# Altium schematic sheet Gate_Driver.SchDoc
size A3; DocumentNumber: 5; SheetNumber: 5; SheetTotal: 10
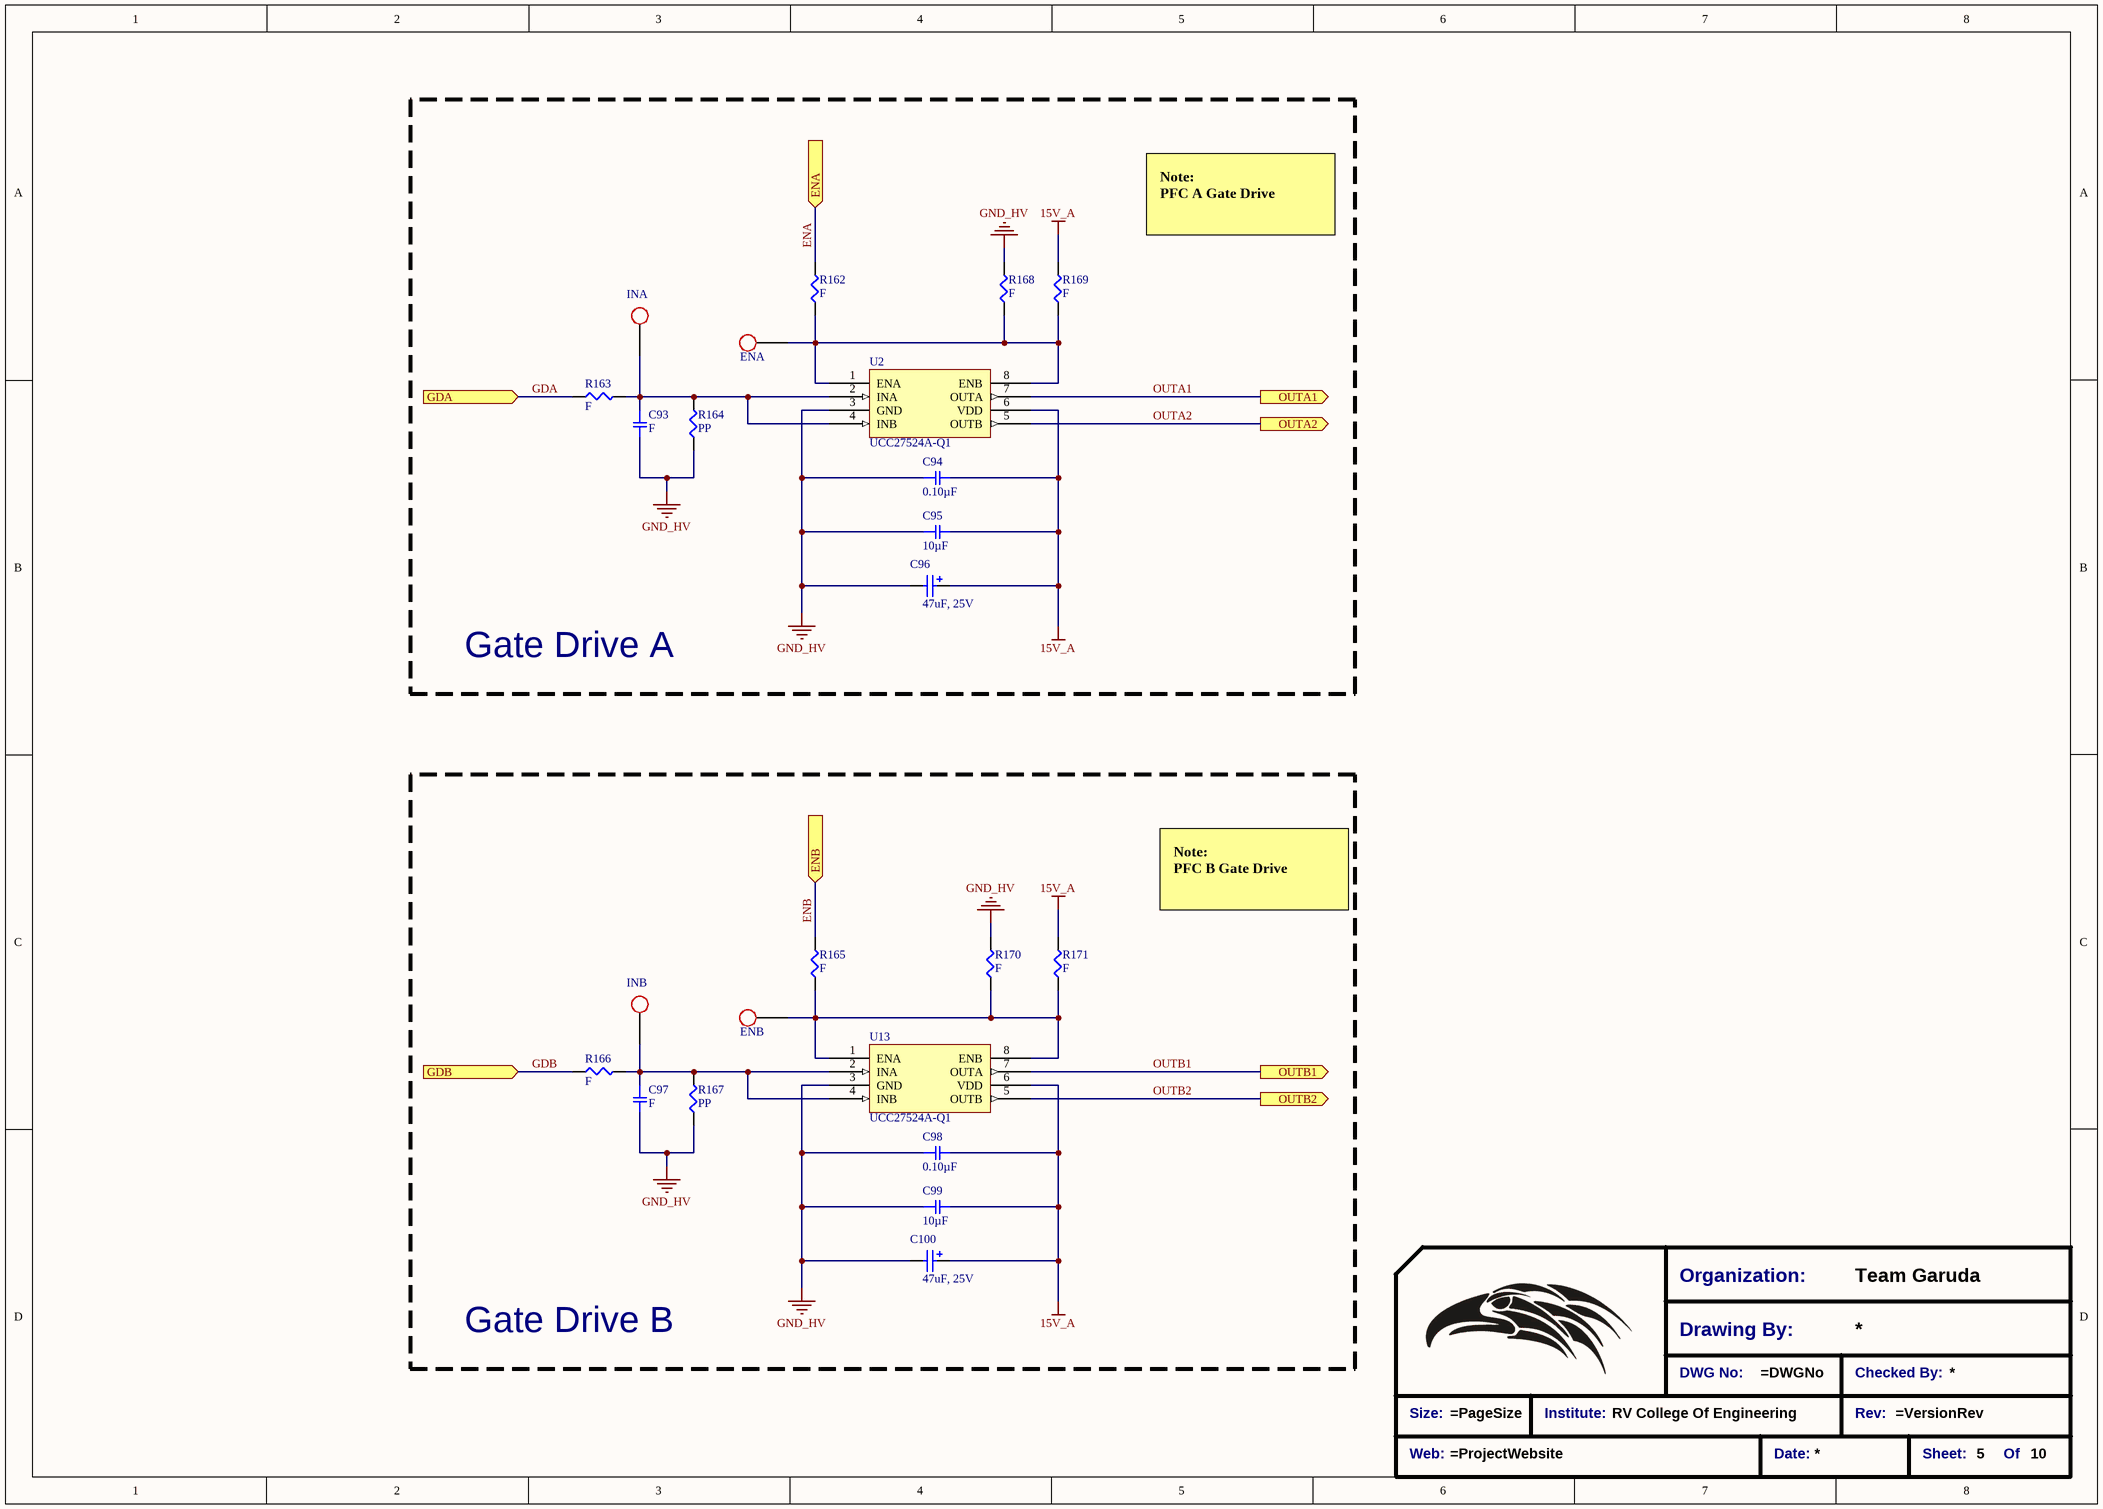
[diagram p0: Gate_Driver.SchDoc]

## Parts
*?  Title_Block  (value not drawn)  (graphical)
C93  F  [SMD-0805C]
C94  0.10µF  [SMD-0805C]
C95  10µF  [SMD-1206C]
C96  47uF, 25V  [WCAP-ASLU_6.3x7.7]
C97  F  [SMD-0805C]
C98  0.10µF  [SMD-0805C]
C99  10µF  [SMD-1206C]
C100  47uF, 25V  [WCAP-ASLU_6.3x7.7]
ENA  Test Point  [Test_point_SMD]  (value not drawn)  (no BOM)
ENB  Test Point  [Test_point_SMD]  (value not drawn)  (no BOM)
INA  Test Point  [Test_point_SMD]  (value not drawn)  (no BOM)
INB  Test Point  [Test_point_SMD]  (value not drawn)  (no BOM)
R162  F  [SMD-0805-RES]
R163  F  [SMD-0805-RES]
R164  PP  [SMD-0805-RES]
R165  F  [SMD-0805-RES]
R166  F  [SMD-0805-RES]
R167  PP  [SMD-0805-RES]
R168  F  [SMD-0805-RES]
R169  F  [SMD-0805-RES]
R170  F  [SMD-0805-RES]
R171  F  [SMD-0805-RES]
U2  UCC27524A-Q1  [SOIC127P570X175_HS-9N - No Thermal]
U13  UCC27524A-Q1  [SOIC127P570X175_HS-9N - No Thermal]

## Blocks framed on the sheet
Gate Drive A: C93-C96 ENA INA R162-R164 R168 R169 U2
Gate Drive B: C97-C100 ENB INB R165-R167 R170 R171 U13

## Ports
ENA (in), ENB (in), GDA (in), GDB (in), OUTA1 (out), OUTA2 (out), OUTB1 (out), OUTB2 (out)

## Nets
15V_A: C94.2 C95.2 C96.2(P) C98.2 C99.2 C100.2(P) R169.2 R171.2 U2.6(VDD) U13.6(VDD)
GND_HV: C93.2 C94.1 C95.1 C96.1(N) C97.2 C98.1 C99.1 C100.1(N) R164.1 R167.1 R168.2 R170.2 U2.3(GND) U13.3(GND)
ENA: R162.2 ; port ENA
ENB: R165.2 ; port ENB
GDA: R163.1 ; port GDA
GDB: R166.1 ; port GDB
OUTA1: U2.7(OUTA) ; port OUTA1
OUTA2: U2.5(OUTB) ; port OUTA2
OUTB1: U13.7(OUTA) ; port OUTB1
OUTB2: U13.5(OUTB) ; port OUTB2
NetC93_1: C93.1 INA.1 R163.2 R164.2 U2.2(INA) U2.4(INB)
NetC97_1: C97.1 INB.1 R166.2 R167.2 U13.2(INA) U13.4(INB)
NetENA_1: ENA.1 R162.1 R168.1 R169.1 U2.1(ENA) U2.8(ENB)
NetENB_1: ENB.1 R165.1 R170.1 R171.1 U13.1(ENA) U13.8(ENB)

## Notes on the sheet
- Note:
  PFC A Gate Drive
- Note:
  PFC B Gate Drive
- (in symbol Title_Block) Organization:; Team Garuda; Drawing By:; DWG No:; Checked By:; Size:; Institute:; RV College Of Engineering; Rev:; Web:; Date:; Sheet:; Of

## Library data of the parts
*? = Title_Block: Standard Title Block
C93 C97 = GCM219R71H334KA55D: CAP CER 0.33UF 50V X7R 0805; Manufacturer: Murata Electronics North America; Factory Stock: 0; Unit Price (USD): 0.4; Minimum Quantity: 1; Value: 0.33µF; Tolerance: ±10%; Datasheets: http://www.murata.com/~/media/webrenewal/support/library/catalog/products/capacitor/mlcc/c03e.ashx; Image: //media.digikey.com/photos/Murata%20Photos/NCP,GCM%20SERIES%200805.jpg; Digi-Key Part Number: 490-8045-1-ND; Part Number: GCM219R71H334KA55D; Quantity Available: 22035; @ qty: 0; Packaging: Cut Tape (CT); Series: GCM; Part Status: Active; Voltage: 50V; Temperature Coefficient: X7R; Operating Temperature: -55°C ~ 125°C; Features: -; Ratings: AEC-Q200; Applications: Automotive; Mounting Type: Surface Mount, MLCC; Package / Case: 0805 (2012 Metric); Size / Dimension: 0.079" L x 0.049" W (2.00mm x 1.25mm); Height - Seated (Max): -; Thickness (Max): 0.037" (0.95mm); Lead Spacing: -; Lead Style: -
C94 C98 = GCD21BR71H104KA01L: CAP CER 0.1UF 50V X7R 0805; Manufacturer: Murata Electronics North America; Factory Stock: 0; Unit Price (USD): 0.24; Minimum Quantity: 1; Tolerance: ±10%; Datasheets: http://www.murata.com/~/media/webrenewal/support/library/catalog/products/capacitor/mlcc/c03e.ashx; Image: //media.digikey.com/Renders/Murata%20Renders/0805%28GxM6%29.jpg; Digi-Key Part Number: 490-11955-1-ND; Part Number: GCD21BR71H104KA01L; Quantity Available: 157; @ qty: 0; Packaging: Cut Tape (CT); Series: GCD; Part Status: Active; Value: 0.10µF; Voltage: 50V; Temperature Coefficient: X7R; Operating Temperature: -55°C ~ 125°C; Features: -; Ratings: AEC-Q200; Applications: Automotive; Mounting Type: Surface Mount, MLCC; Package / Case: 0805 (2012 Metric); Size / Dimension: 0.079" L x 0.049" W (2.00mm x 1.25mm); Height - Seated (Max): -; Thickness (Max): 0.049" (1.25mm); Lead Spacing: -; Lead Style: -
C95 C99 = GRT31CR61E106ME01L: CAP CER 10UF 25V X5R 1206; Manufacturer: Murata Electronics North America; Factory Stock: 0; Unit Price (USD): 0.56; Minimum Quantity: 1; Tolerance: ±20%; Datasheets: http://search.murata.co.jp/Ceramy/image/img/A01X/G101/ENG/GRT31CR61E106ME01-01.pdf; Image: //media.digikey.com/Renders/Murata%20Renders/GR331BD72E473KW01L.jpg; Digi-Key Part Number: 490-12449-1-ND; Part Number: GRT31CR61E106ME01L; Quantity Available: 4000; @ qty: 0; Packaging: Cut Tape (CT); Series: GRT; Part Status: Active; Value: 10µF; Voltage: 25V; Temperature Coefficient: X5R; Operating Temperature: -55°C ~ 85°C; Features: -; Ratings: AEC-Q200; Applications: Automotive; Mounting Type: Surface Mount, MLCC; Package / Case: 1206 (3216 Metric); Size / Dimension: 0.126" L x 0.063" W (3.20mm x 1.60mm); Height - Seated (Max): -; Thickness (Max): 0.071" (1.80mm); Lead Spacing: -; Lead Style: -
C96 C100 = 865090445006: WCAP-ASLU Aluminium Electrolytic Capacitors, D6.3mm x L7.7mm, 47uF, +/-20%, 25VDC; Dissipation Factor: 16%; Leakage Current: 2.35uA; Endurance: 1000h; Technical Reference: ASBD077470M025DVCTCA000; Ripple Current max.: 65mA; ComponentLink1Description: Manufacturer; ComponentLink1URL: http://www.we-online.de; ComponentLink2Description: Datasheet; ComponentLink2URL: https://katalog.we-online.com/pbs/datasheet/865090445006.pdf; Mounting Technology: SMD; Operating Temperature: -40 to +85degC; Packaging: Tape and Reel; Part Number: 865090445006; Publisher: Wurth Elektronik; Capacitance: 47uF; Diameter: 6.3mm; Length: 7.7mm; Published Date: August 2019; Rated Voltage: 25VDC; Capacitance Tolerance: +/-20%
ENA ENB INA INB = Test Point: TP
R162-R171 = ERJ-6BQF6R8V: RES SMD 6.8 OHM 1% 1/3W 0805; Manufacturer: Panasonic Electronic Components; Factory Stock: 0; Unit Price (USD): 0.07013; @ qty: 1500; Minimum Quantity: 1; Value: 6.8; Power (Watts): 0.333W, 1/3W; Temperature Coefficient: ±200ppm/°C; Part Number: ERJ-6BQF6R8V; Datasheets: https://industrial.panasonic.com/cdbs/www-data/pdf/RDA0000/AOA0000C239.pdf; Image: //media.digikey.com/Renders/Panasonic%20Renders/ERJ-0805%20Pkg.jpg; Digi-Key Part Number: P15997CT-ND; Quantity Available: 7268; Packaging: Cut Tape (CT); Series: ERJ; Part Status: Active; Tolerance: ±1%; Composition: Thick Film; Features: Automotive AEC-Q200, Current Sense; Operating Temperature: -55°C ~ 125°C; Package / Case: 0805 (2012 Metric); Supplier Device Package: 0805; Size / Dimension: 0.079" L x 0.049" W (2.00mm x 1.25mm); Height - Seated (Max): 0.028" (0.70mm); Number of Terminations: 2; Failure Rate: -
U2 U13 = UCC27524A